# EAGLE schematic chipchestra-v03 (EAGLE 8.0.0)
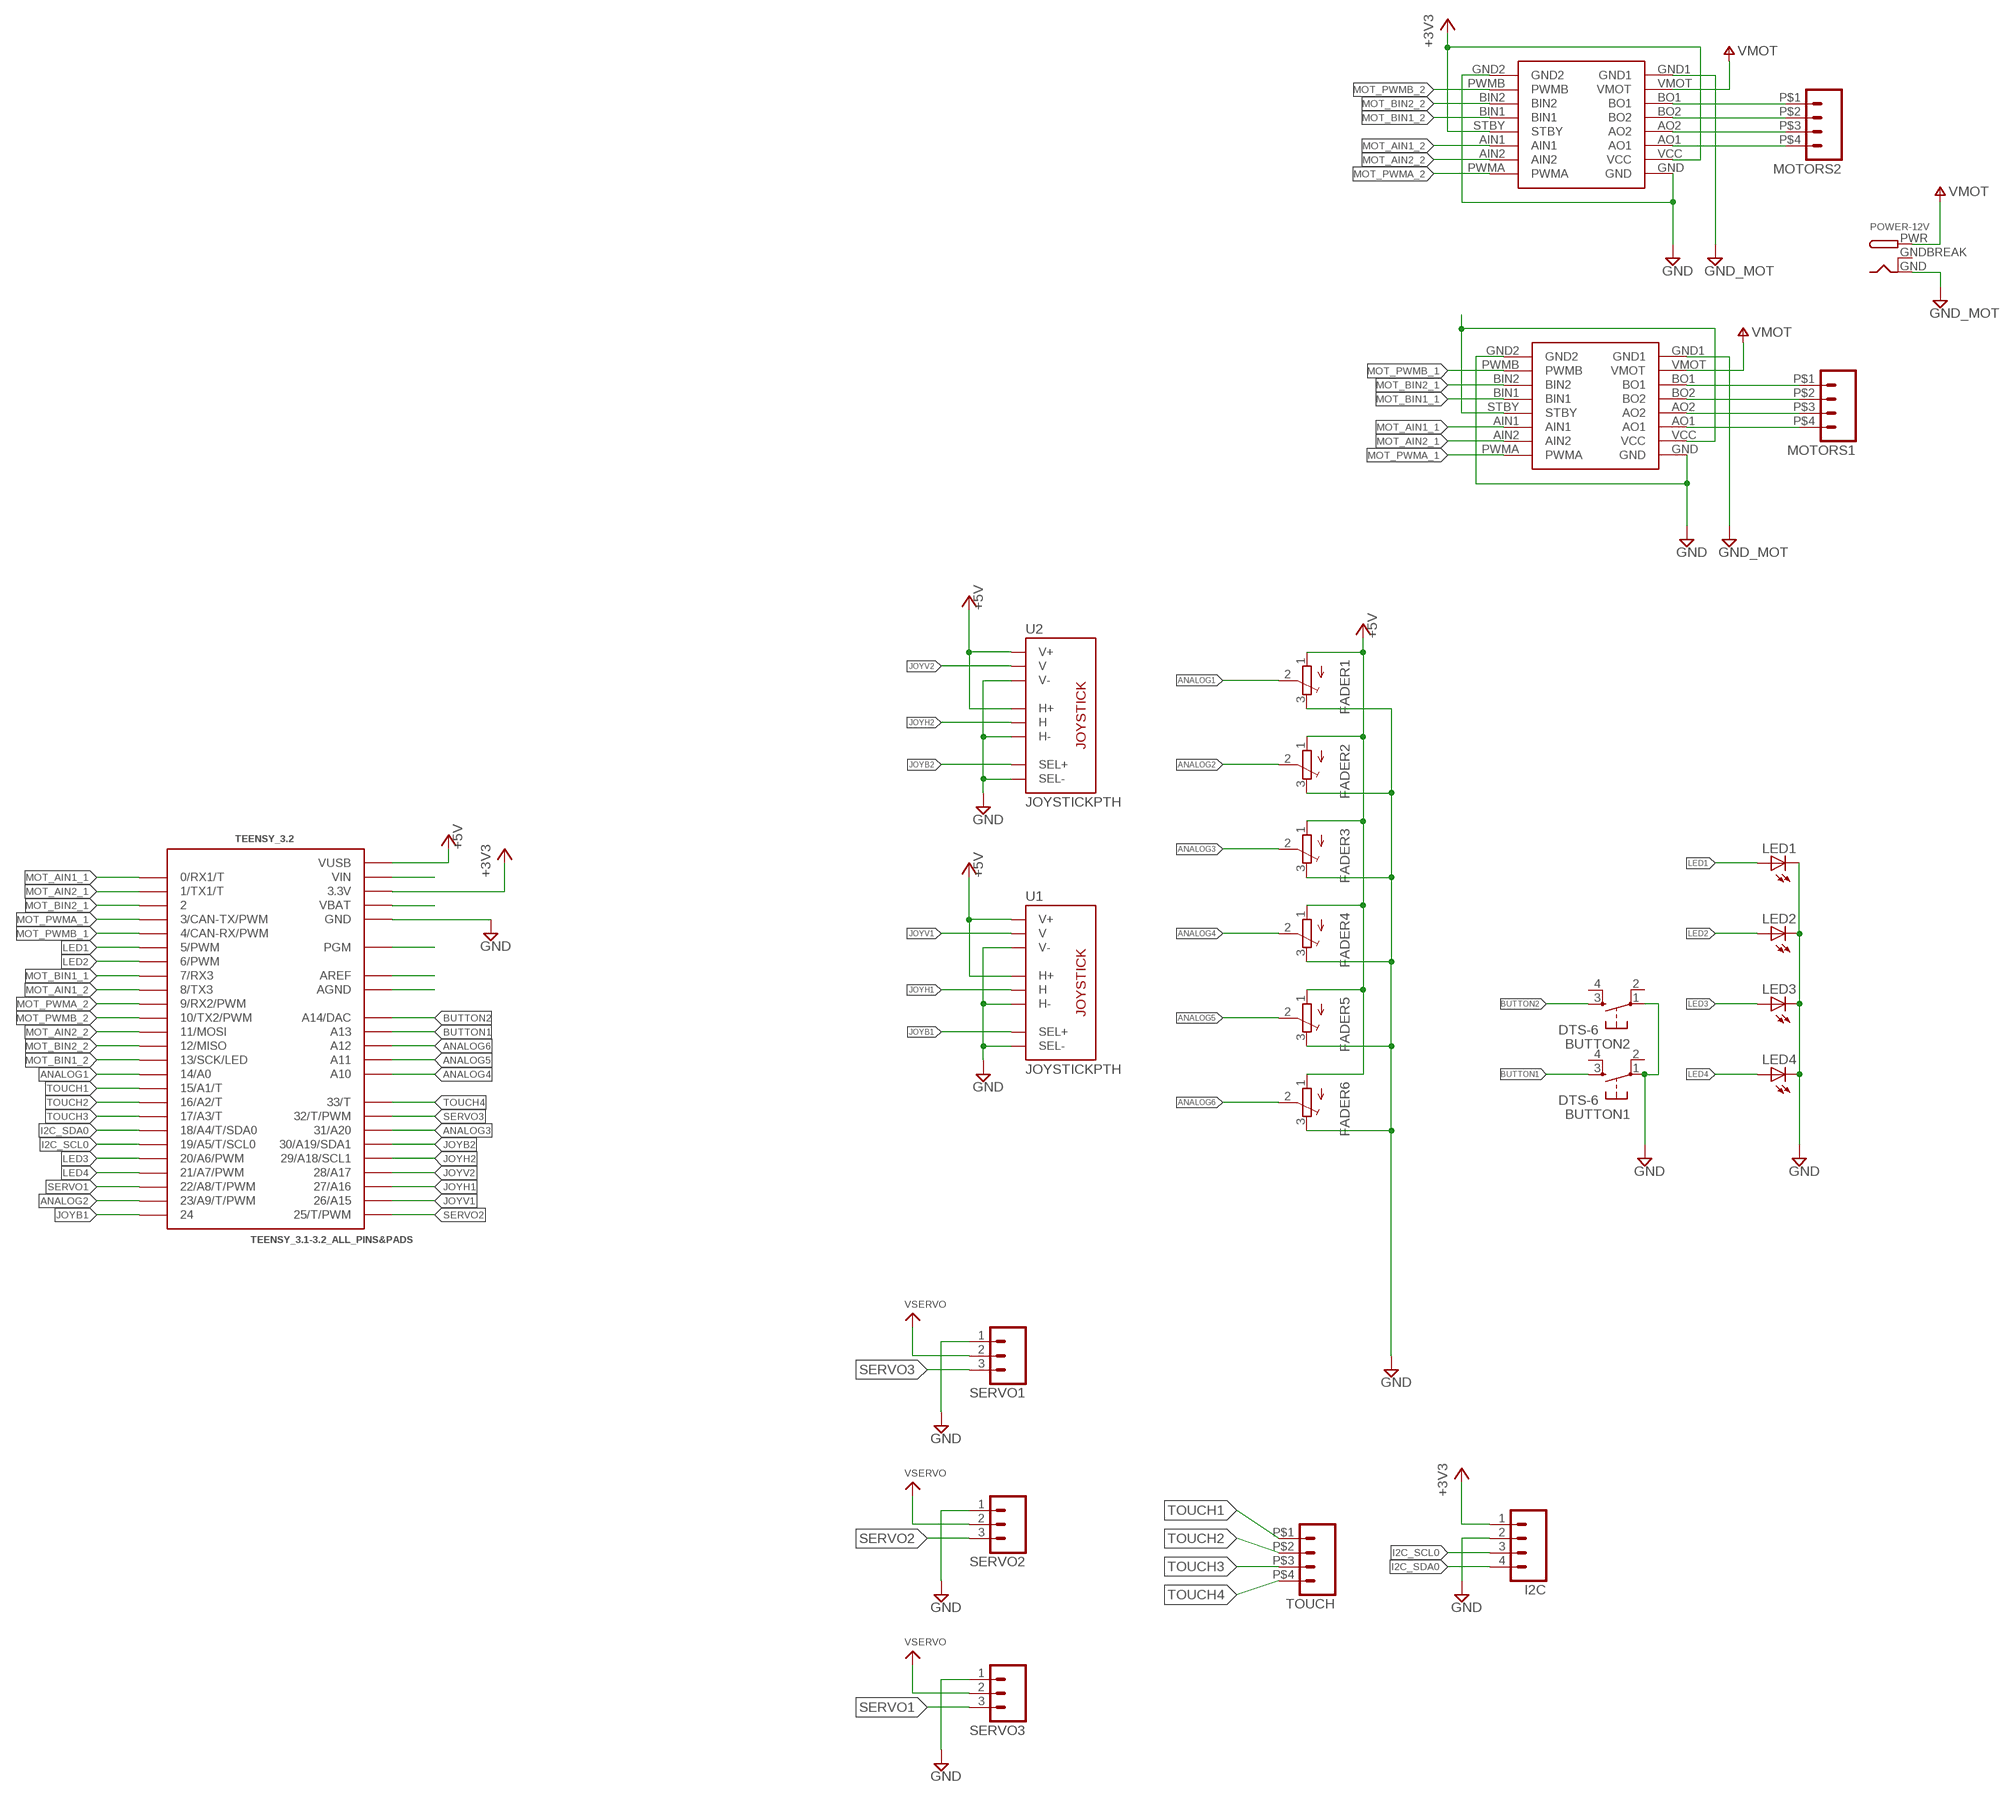
[diagram p0: schematic, sheet 1]

## Parts
BUTTON1  DTS-6  [DTS-6]
BUTTON2  DTS-6  [DTS-6]
FADER1  TRIMPOT3386  [TRIM-3386]
FADER2  TRIMPOT3386  [TRIM-3386]
FADER3  TRIMPOT3386  [TRIM-3386]
FADER4  TRIMPOT3386  [TRIM-3386]
FADER5  TRIMPOT3386  [TRIM-3386]
FADER6  TRIMPOT3386  [TRIM-3386]
I2C  M04LOCK  [1X04_LOCK]
LED1  LED3MM  [LED3MM]
LED2  LED3MM  [LED3MM]
LED3  LED3MM  [LED3MM]
LED4  LED3MM  [LED3MM]
MOTORS1  M04  [SPRINGTERMINAL-2.54MM-4]
MOTORS2  M04  [SPRINGTERMINAL-2.54MM-4]
POWER-12V  DCBARRELPTH  [DCJACK_2MM_PTH]
SERVO1  M03LOCK  [1X03_LOCK]
SERVO2  M03LOCK  [1X03_LOCK]
SERVO3  M03LOCK  [1X03_LOCK]
TEENSY_3.2  TEENSY_3.1-3.2_ALL_PINS&PADS  [TEENSY_3.0-3.2_ALL_PINS_&_PADS]
TOUCH  M04  [SPRINGTERMINAL-2.54MM-4]
U1  JOYSTICKPTH  [JOYSTICK]
U2  JOYSTICKPTH  [JOYSTICK]
U$6  POLOLU_TB6612FNG  [POLOLU_TB6612FNG]
U$7  POLOLU_TB6612FNG  [POLOLU_TB6612FNG]

## Nets
+3V3: I2C.1 TEENSY_3.2.3.3V TEENSY_3.2.3.3V1(3.3V) TEENSY_3.2.3.3V2(3.3V) U$6.STBY U$6.VCC
+5V: FADER1.1(A) FADER2.1(A) FADER3.1(A) FADER4.1(A) FADER5.1(A) FADER6.1(A) TEENSY_3.2.VUSB U1.H1(H+) U1.V1(V+) U2.H1(H+) U2.V1(V+)
ANALOG1: FADER1.2(S) TEENSY_3.2.14/A0
ANALOG2: FADER2.2(S) TEENSY_3.2.23/A9(23/A9/T/PWM)
ANALOG3: FADER3.2(S) TEENSY_3.2.31(31/A20)
ANALOG4: FADER4.2(S) TEENSY_3.2.A10
ANALOG5: FADER5.2(S) TEENSY_3.2.A11
ANALOG6: FADER6.2(S) TEENSY_3.2.A12
BUTTON1: BUTTON1.3 TEENSY_3.2.A13
BUTTON2: BUTTON2.3 TEENSY_3.2.RESET/DAC(A14/DAC)
GND: BUTTON1.1 BUTTON2.1 FADER1.3(E) FADER2.3(E) FADER3.3(E) FADER4.3(E) FADER5.3(E) FADER6.3(E) I2C.2 LED1.K(C) LED2.K(C) LED3.K(C) LED4.K(C) SERVO1.1 SERVO2.1 SERVO3.1 TEENSY_3.2.GND TEENSY_3.2.GND1(GND) TEENSY_3.2.GND2(GND) U1.B2A(SEL-) U1.H3(H-) U1.V3(V-) U2.B2A(SEL-) U2.H3(H-) U2.V3(V-) U$6.GND U$6.GND2 U$7.GND U$7.GND2
GND_MOT [Power]: POWER-12V.GND U$6.GND1 U$7.GND1
I2C_SCL0: I2C.3 TEENSY_3.2.19/A5(19/A5/T/SCL0)
I2C_SDA0: I2C.4 TEENSY_3.2.18/A4(18/A4/T/SDA0)
JOYB1: TEENSY_3.2.24 U1.B1A(SEL+)
JOYB2: TEENSY_3.2.30(30/A19/SDA1) U2.B1A(SEL+)
JOYH1: TEENSY_3.2.27(27/A16) U1.H2(H)
JOYH2: TEENSY_3.2.29(29/A18/SCL1) U2.H2(H)
JOYV1: TEENSY_3.2.26(26/A15) U1.V2(V)
JOYV2: TEENSY_3.2.28(28/A17) U2.V2(V)
LED1: LED1.A TEENSY_3.2.5(5/PWM)
LED2: LED2.A TEENSY_3.2.6(6/PWM)
LED3: LED3.A TEENSY_3.2.20/A6(20/A6/PWM)
LED4: LED4.A TEENSY_3.2.21/A7(21/A7/PWM)
MOT_AIN1_1: TEENSY_3.2.0(0/RX1/T) U$7.AIN1
MOT_AIN1_2: TEENSY_3.2.8(8/TX3) U$6.AIN1
MOT_AIN2_1: TEENSY_3.2.1(1/TX1/T) U$7.AIN2
MOT_AIN2_2: TEENSY_3.2.11(11/MOSI) U$6.AIN2
MOT_BIN1_1: TEENSY_3.2.7(7/RX3) U$7.BIN1
MOT_BIN1_2: TEENSY_3.2.13(13/SCK/LED) U$6.BIN1
MOT_BIN2_1: TEENSY_3.2.2 U$7.BIN2
MOT_BIN2_2: TEENSY_3.2.12(12/MISO) U$6.BIN2
MOT_PWMA_1: TEENSY_3.2.3(3/CAN-TX/PWM) U$7.PWMA
MOT_PWMA_2: TEENSY_3.2.9(9/RX2/PWM) U$6.PWMA
MOT_PWMB_1: TEENSY_3.2.4(4/CAN-RX/PWM) U$7.PWMB
MOT_PWMB_2: TEENSY_3.2.10(10/TX2/PWM) U$6.PWMB
N$10: TEENSY_3.2.VBAT
N$12: U$7.STBY U$7.VCC
N$45 [Power]: MOTORS1.P$1 U$7.BO1
N$46 [Power]: MOTORS1.P$2 U$7.BO2
N$48: TEENSY_3.2.VIN
N$52 [Power]: MOTORS1.P$3 U$7.AO2
N$53: TEENSY_3.2.PGM
N$54 [Power]: MOTORS1.P$4 U$7.AO1
N$55: TEENSY_3.2.AREF
N$56: TEENSY_3.2.AGND
N$57 [Power]: MOTORS2.P$1 U$6.BO1
N$63 [Power]: MOTORS2.P$2 U$6.BO2
N$64 [Power]: MOTORS2.P$3 U$6.AO2
N$65 [Power]: MOTORS2.P$4 U$6.AO1
SERVO1: SERVO3.3 TEENSY_3.2.22/A8(22/A8/T/PWM)
SERVO2: SERVO2.3 TEENSY_3.2.25(25/T/PWM)
SERVO3: SERVO1.3 TEENSY_3.2.32(32/T/PWM)
TOUCH1: TEENSY_3.2.15/A1(15/A1/T) TOUCH.P$1
TOUCH2: TEENSY_3.2.16/A2(16/A2/T) TOUCH.P$2
TOUCH3: TEENSY_3.2.17/A3(17/A3/T) TOUCH.P$3
TOUCH4: TEENSY_3.2.33(33/T) TOUCH.P$4
VBAT [Power]: SERVO1.2 SERVO2.2 SERVO3.2 ; supply symbol labelled VSERVO
VMOT [Power]: POWER-12V.PWR U$6.VMOT U$7.VMOT ; supply symbol labelled V+
Unconnected: BUTTON1.2 BUTTON1.4 BUTTON2.2 BUTTON2.4

## Power pins joined to a net without a drawn wire
GNDBREAK: POWER-12V.GNDBREAK

## Library data of the parts
BUTTON1 BUTTON2 = switch-tact:DTS-6
FADER1-FADER6 = adafruit:TRIMPOT: SMT trimmer potentiometer part number TC33X http://www.ladyada.net/library/eagle
I2C MOTORS1 MOTORS2 TOUCH = CMU-ArtFab:M04: Header 4 Standard 4-pin 0.1" header. Use with straight break away headers (SKU : PRT-00116), right angle break away headers (PRT-00553), swiss pins (PRT-00743), machine pins (PRT-00117), and female headers (PRT-00115). Molex polarized connector foot print use with SKU : PRT-08231 with associated crimp pins and housings. 1MM SMD Version SKU: PRT-10208
LED1-LED4 = adafruit:LED: LED OSRAM: - CHIPLED LG R971, LG N971, LY N971, LG Q971, LY Q971, LO R971, LY R971 LH N974, LH R974 LS Q976, LO Q976, LY Q976 LO Q996 - Hyper CHIPLED LW Q18S LB Q993, LB Q99A, LB R99A - SideLED LS A670, LO A670, LY A670, LG A670, LP A670 LB A673, LV A673, LT A673, LW A673 LH A674 LY A675 LS A676, LA A676, LO A676, LY A676, LW A676 LS A679, LY A679, LG A679 - Hyper Micro SIDELED® LS Y876, LA Y876, LO Y876, LY Y876 LT Y87S - SmartLED LW L88C, LW L88S LB L89C, LB L89S, LG L890 LS L89K, LO L89K, LY L89K LS L896, LA L896, LO L896, LY L896 - TOPLED LS T670, LO T670, LY T670, LG T670, LP T670 LSG T670, LSP T670, LSY T670, LOP T670, LYG T670 LG T671, LOG T671, LSG T671 LB T673, LV T673, LT T673, LW T673 LH T674 LS T676, LA T676, LO T676, LY T676, LB T676, LH T676, LSB T676, LW T676 LB T67C, LV T67C, LT T67C, LS T67K, LO T67K, LY T67K, LW E67C LS E67B, LA E67B, LO E67B, LY E67B, LB E67C, LV E67C, LT E67C LW T67C LS T679, LY T679, LG T679 LS T770, LO T770, LY T770, LG T770, LP T770 LB T773, LV T773, LT T773, LW T773 LH T774 LS E675, LA E675, LY E675, LS T675 LS T776, LA T776, LO T776, LY T776, LB T776 LHGB T686 LT T68C, LB T68C - Hyper Mini TOPLED® LB M676 - Mini TOPLED Santana® LG M470 LS M47K, LO M47K, LY M47K Source: http://www.osram.convergy.de/
POWER-12V = adafruit:DCBARREL: 2.0mm DC Barrel Jack DCJACK_2MM_PTH - Through Hole Jack (4UConnector: 05537)
SERVO1-SERVO3 = SparkFun-Connectors:M03: Header 3 Standard 3-pin 0.1" header. Use with straight break away headers (SKU : PRT-00116), right angle break away headers (PRT-00553), swiss pins (PRT-00743), machine pins (PRT-00117), and female headers (PRT-00115). Molex polarized connector foot print use with SKU : PRT-08232 with associated crimp pins and housings.
TEENSY_3.2 = Teensy_3_and_LC_Series_Boards_v1.4:TEENSY_3.1-3.2_ALL_PINS&PADS: Footprint for Teensy 3.1 or 3.2 board using all pads and all through-holes. Pads need a 2x7 0.1" SMD header.
U1 U2 = adafruit:JOYSTICK: Thumb Joystick Joystick commonly found in PS2 controllers. Two pots and a select switch. Adapted from Sparkfun Library (but for more common 6mm switch sticks)
U$6 U$7 = CMU-ArtFab:POLOLU_TB6612FNG

## Net classes
0 default: width 0.152 mm, clearance 0.152 mm
1 GND: width 0.508 mm, clearance 0.152 mm
2 Power: width 0.508 mm, clearance 0.152 mm